# EAGLE design ESP12 Breakout (EAGLE 9.6.2)
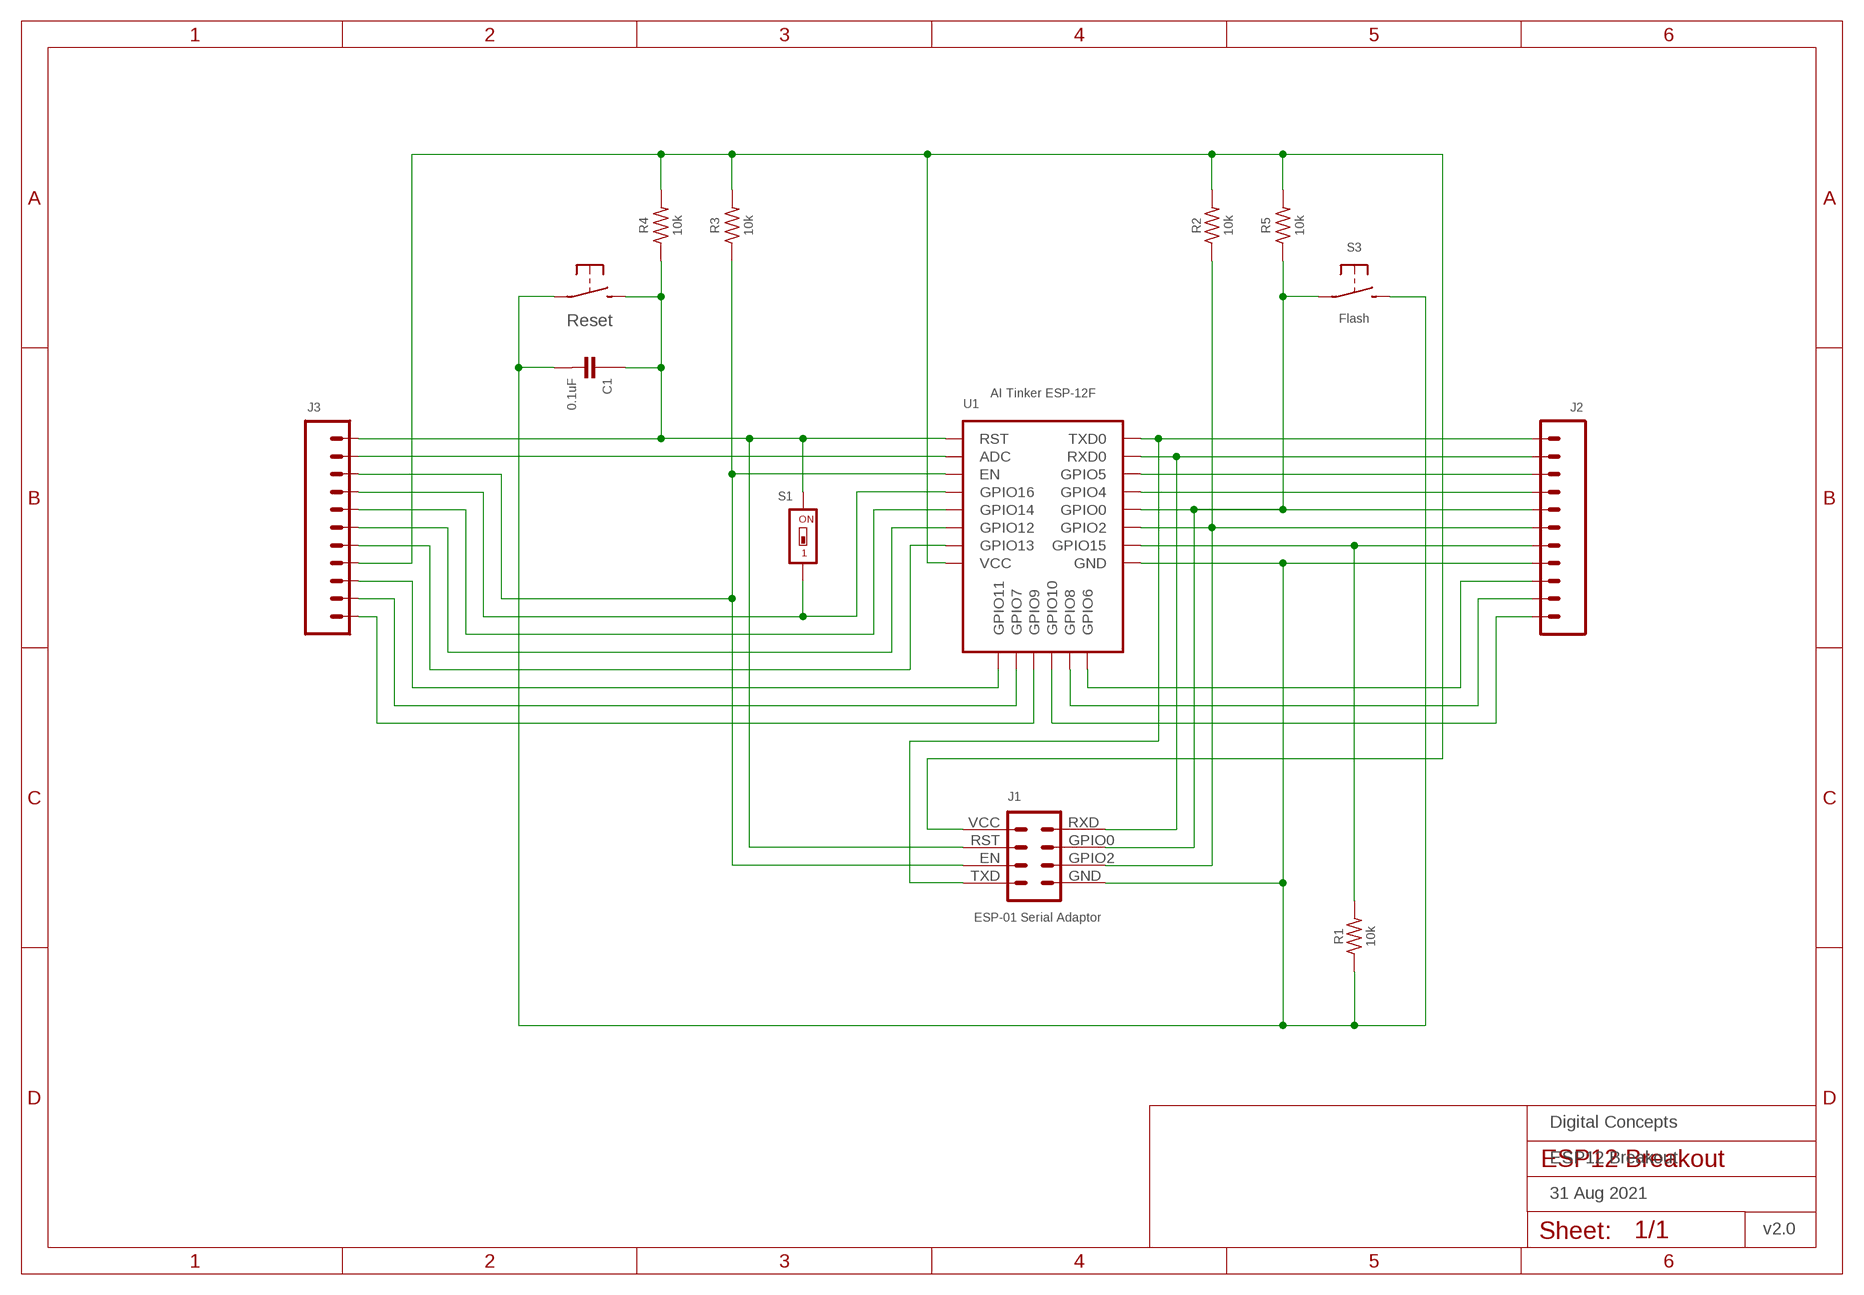
[diagram p0: schematic, sheet 1]
FRAME1 (A4L-LOC): DATE: 31 Aug 2021; OWNER: Digital Concepts; TITLE: ESP12 Breakout; VERSION: v2.0

## Parts
C1  0.1uF  CAPACITOR-0805  [C0805]
J1  ESP-01 Serial Adaptor  ESP-01-SERIAL-ADAPTOR  [CONN_2X4-ESP-01-SERIAL]
J2  HEADER-1X11-GENERIC  [CONN_11-GENERIC]
J3  HEADER-1X11-GENERIC  [CONN_11-GENERIC]
R1  10k  RESISTORR0805  [R0805]
R2  10k  RESISTORR0805  [R0805]
R3  10k  RESISTORR0805  [R0805]
R4  10k  RESISTORR0805  [R0805]
R5  10k  RESISTORR0805  [R0805]
S1  Wake  SWITCH-DIP-SWS001  [SMD-001]
S2  Reset  SWITCH-MOMENTARY-2-PIN  [SWITCH-2-PAD]
S3  Flash  SWITCH-MOMENTARY-2-PIN  [SWITCH-2-PAD]
U1  AI Tinker ESP-12F  ESP-12E/F  [ESP-12E/F]

## Nets
GND: C1.2 J1.GND J2.4 R1.1 S2.P$1(P) S3.P$2(S) U1.GND
N$1: J3.1 U1.GPIO9
N$2: J2.5 R1.2 U1.GPIO15
N$3: J3.7 U1.GPIO14
N$4: C1.1 J1.RST J3.11 R4.1 S1.2 S2.P$2(S) U1.RST
N$5: J3.6 U1.GPIO12
N$6: J3.5 U1.GPIO13
N$7: J3.10 U1.ADC
N$8: J1.EN J3.9 R3.1 U1.EN
N$9: J2.9 U1.GPIO5
N$10: J1.TXD J2.11 U1.TXD0
N$11: J1.GPIO2 J2.6 R2.1 U1.GPIO2
N$12: J2.8 U1.GPIO4
N$13: J1.GPIO0 J2.7 R5.1 S3.P$1(P) U1.GPIO0
N$15: J2.1 U1.GPIO10
N$16: J1.RXD J2.10 U1.RXD0
N$17: J2.3 U1.SCLK(GPIO6)
N$18: J3.8 S1.1 U1.GPIO16
N$19: J2.2 U1.MOSI(GPIO8)
N$22: J3.3 U1.CS0(GPIO11)
N$23: J3.2 U1.MISO(GPIO7)
VCC: J1.VCC J3.4 R2.2 R3.2 R4.2 R5.2 U1.VCC

## Library data of the parts
C1 = digitalconcepts:CAPACITOR-0805: 0805 Capacitor
J1 = digitalconcepts:ESP-01-SERIAL-ADAPTOR: ESP-01 Serial Adpator
J2 J3 = digitalconcepts:HEADER-1X11-GENERIC: Single Row 11-Pin Header
R1-R5 = digitalconcepts:RESISTOR: Resistor; SPICEPREFIX: R
S1 = digitalconcepts:SWITCH-DIP-SWS001: SMD Dip Switch 1 pol.
S2 S3 = digitalconcepts:SWITCH-MOMENTARY-2-PIN: 2 Pin Momentary Switch
U1 = digitalconcepts:ESP-12E/F: AI Thinker ESP-12E/F MCU

## Board
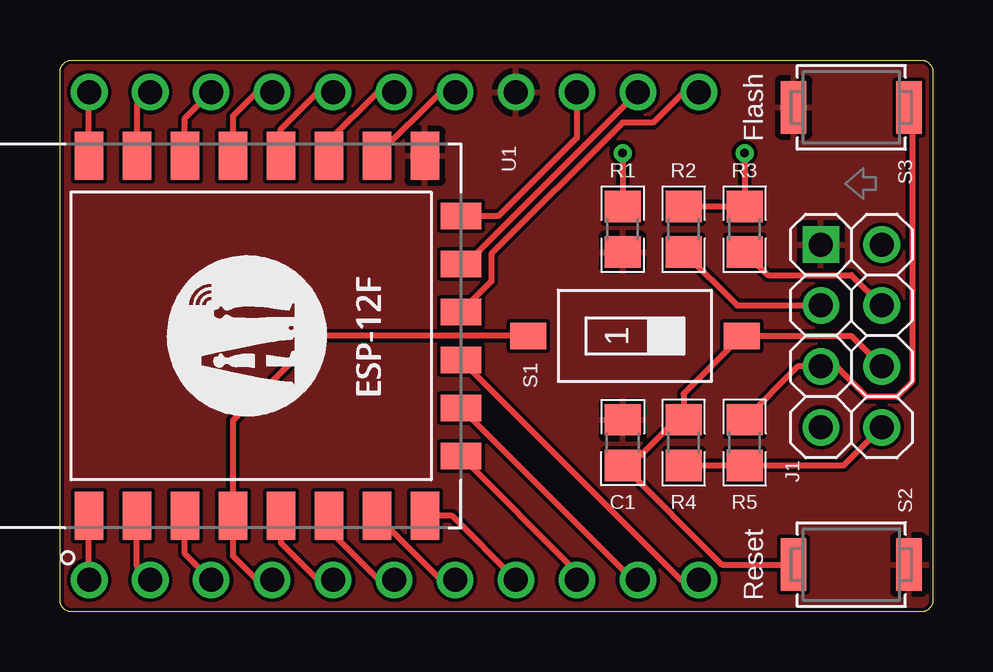
[diagram p1: board, top side]
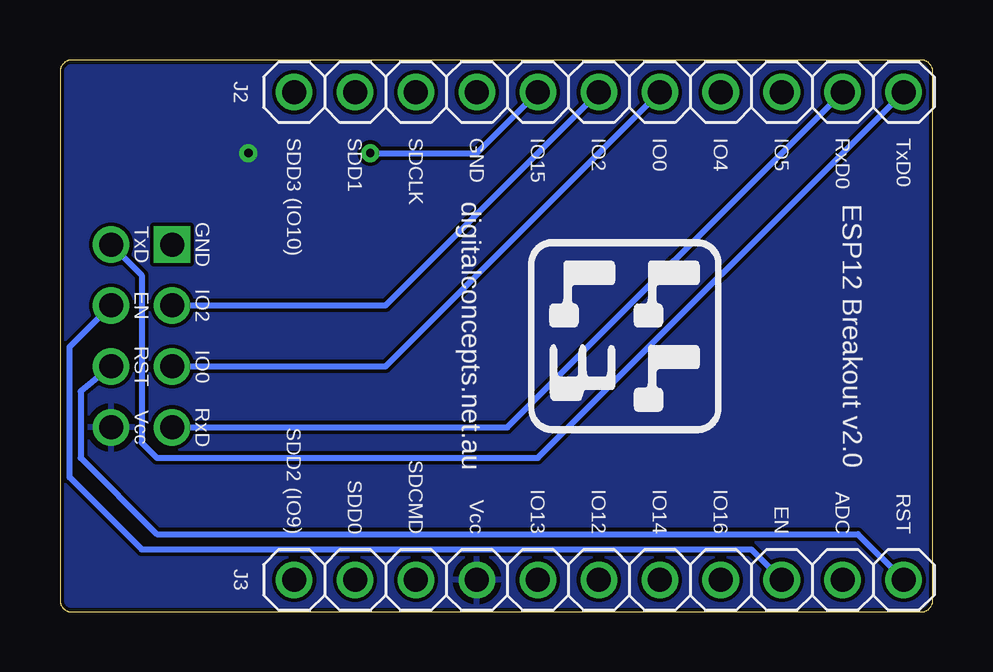
[diagram p2: board, bottom side, seen from below]

Size 36.37 x 23 mm. Coordinates in mm from the lower left corner, seen from the top.
Outline: 35.91,23 35.94,23 35.97,22.99 36.01,22.98 36.04,22.97 36.07,22.96 36.1,22.95 36.13,22.93 36.15,22.91 36.18,22.9 36.2,22.88 36.23,22.85 36.25,22.83 36.27,22.81 36.29,22.78 36.3,22.75 36.32,22.72 36.33,22.69 36.35,22.66 36.36,22.63 36.36,22.6 36.37,22.57 36.37,22.53 36.37,0.47 36.37,0.43 36.36,0.4 36.36,0.37 36.35,0.34 36.33,0.31 36.32,0.28 36.3,0.25 36.29,0.22 36.27,0.19 36.25,0.17 36.2,0.12 36.18,0.1 36.15,0.09 36.13,0.07 36.1,0.05 36.07,0.04 36.04,0.03 36.01,0.02 35.97,0.01 35.94,0 35.91,0 0.47,0 0.43,0 0.4,0.01 0.37,0.02 0.34,0.03 0.28,0.05 0.25,0.07 0.22,0.09 0.19,0.1 0.17,0.12 0.12,0.17 0.1,0.19 0.09,0.22 0.07,0.25 0.05,0.28 0.04,0.31 0.03,0.34 0.02,0.37 0.01,0.4 0,0.43 0,0.47 0,22.53 0,22.57 0.01,22.6 0.02,22.63 0.03,22.66 0.04,22.69 0.05,22.72 0.07,22.75 0.09,22.78 0.1,22.81 0.12,22.83 0.15,22.85 0.17,22.88 0.19,22.9 0.22,22.91 0.25,22.93 0.28,22.95 0.34,22.97 0.37,22.98 0.4,22.99 0.43,23 0.47,23 35.91,23
Copper layers (1*16): Top 0.035mm / dielectric 1.5mm / Bottom 0.035mm
Design rules "default *": minimum track width 6mil, minimum drill 0.35mm, track to track 6mil, track to pad 6mil, pad to pad 6mil, via to via 6mil, smd to smd 6mil, copper to edge 6mil, drill to drill 6mil, minimum pad ring 10mil, minimum via ring 8mil, stop-mask expansion 4mil, vias tented up to drill 0mil, thermal gap 10mil

### Footprints (pad centres in the part's own frame; a part is rotated, then mirrored left to right if it is on the bottom)
C0805 = smd 1.3 x 1.5: 1 -0.95,0; 2 0.95,0
CONN_2X4-ESP-01-SERIAL = drill 1 pad 1.524: EN 2.54,2.54; GPIO0 5.08,0; GPIO2 2.54,0; RST 5.08,2.54; RXD 7.62,0; TXD 0,2.54; VCC 7.62,2.54 | drill 1 pad 1.524 square: GND 0,0
CONN_11-GENERIC = drill 1 pad 1.524: 1 0,0; 2 2.54,0; 3 5.08,0; 4 7.62,0; 5 10.16,0; 6 12.7,0; 7 15.24,0; 8 17.78,0; 9 20.32,0; 10 22.86,0; 11 25.4,0
R0805 = smd 1.3 x 1.5: 1 -0.95,0; 2 0.95,0
SMD-001 = smd 1.1 x 1.5: 1 0,-4.45; 2 0,4.45
SWITCH-2-PAD = smd 1.067 x 2.184: P$1 -2.4,0; P$2 2.4,0
ESP-12E/F = smd 2 x 1.2: ADC -7.5,5; EN -7.5,3; GND 7.5,-7; GPIO0 7.5,-1; GPIO2 7.5,-3; GPIO4 7.5,1; GPIO5 7.5,3; GPIO12 -7.5,-3; GPIO13 -7.5,-5; GPIO14 -7.5,-1; GPIO15 7.5,-5; GPIO16 -7.5,1; RST -7.5,7; RXD0 7.5,5; TXD0 7.5,7; VCC -7.5,-7 | smd 1.1 x 1.7: CS0 -5,-8.5; GPIO9 -1,-8.5; GPIO10 1,-8.5; MISO -3,-8.5; MOSI 3,-8.5; SCLK 5,-8.5

### Placement (x,y rotation side)
C1  23.44,7.06 90 top
J1  31.7,15.31 270 top
J2  26.62,21.66 0 bottom
J3  26.62,1.34 0 bottom
R1  23.44,15.95 90 top
R2  25.98,15.95 90 top
R3  28.52,15.95 90 top
R4  25.98,7.06 270 top
R5  28.52,7.06 270 top
S1  23.95,11.5 270 top
S2  32.97,1.98 180 top
S3  32.97,21.03 180 top
U1  8.2,11.5 90 top

### Tracks (layer width: path | path; a pad name or v marks a point on that pad's centre or on a via)
GND
  pour Top (rank 3): -1.32,24.2 37.41,24.2 37.41,-1.2 -1.32,-1.2
N$1
  Top 0.254: U1.GPIO9 25.86,1.34 J3.1
N$2  (via drill 0.35)
  Top 0.254: U1.GPIO15 15.86,21.66 J2.5 | v23.44,19.12 R1.2
  Bottom 0.254: J2.5 19,19.12 v23.44,19.12
N$3
  Top 0.254: U1.GPIO14 9.2,2.88 10.74,1.34 J3.7
N$4
  Top 0.254: J1.RST 32.97,11.5 S1.2 25.98,9.08 R4.1 25.68,8.01 23.78,6.11 C1.1 27.57,1.98 S2.P$2 | J3.11 1.2,1.36 U1.RST
  Bottom 0.254: J1.RST 35.51,9.19 35.51,6.42 32.33,3.25 3.12,3.25 J3.11
N$5
  Top 0.254: U1.GPIO12 11.2,3.42 13.28,1.34 J3.6
N$6
  Top 0.254: U1.GPIO13 15.86,1.34 J3.5
N$7
  Top 0.254: U1.ADC 3.2,1.9 J3.10
N$8
  Top 0.254: R3.1 29.48,14.04 32.97,14.04 J1.EN | U1.EN 5.2,2.44 J3.9
  Bottom 0.254: J1.EN 35.97,11.04 35.97,5.61 32.97,2.61 7.57,2.61 J3.9
N$9
  Top 0.254: U1.GPIO5 5.2,20.39 5.2,20.57 J2.9
N$10
  Top 0.254: U1.TXD0 1.2,21.65 J2.11
  Bottom 0.254: J1.TXD 32.97,14.04 32.97,7.06 32.33,6.42 16.46,6.42 J2.11
N$11
  Top 0.254: U1.GPIO2 11.2,19.64 13.23,21.66 J2.6 | R2.1 28.21,12.77 J1.GPIO2
  Bottom 0.254: J1.GPIO2 22.81,12.77 J2.6
N$12
  Top 0.254: U1.GPIO4 7.2,20.66 8.2,21.66 J2.8
N$13
  Top 0.254: U1.GPIO0 9.2,20.12 | 9.2,20.12 | 9.2,20.12 10.74,21.66 J2.7 | R5.1 30.75,10.23 J1.GPIO0 32.33,10.23 33.6,8.96 34.87,8.96 35.51,9.6 35.51,20.89 S3.P$1
  Bottom 0.254: J1.GPIO0 22.81,10.23 J2.7
N$15
  Top 0.254: U1.GPIO10 17.97,13.77 17.97,14.92 23.44,20.39 24.71,20.39 25.98,21.66 J2.1
N$16
  Top 0.254: U1.RXD0 3.2,21.11 J2.10
  Bottom 0.254: J1.RXD 17.73,7.69 J2.10
N$17
  Top 0.254: U1.SCLK 18.28,16.5 21.54,19.76 J2.3
N$18
  Top 0.254: S1.1 10.74,11.5 7.2,7.96 U1.GPIO16 7.2,2.34 8.2,1.34 J3.8
N$19
  Top 0.254: J2.2 16.92,14.5 U1.MOSI
N$22
  Top 0.254: U1.CS0 21.54,1.67 J3.3
N$23
  Top 0.254: U1.MISO 23.86,1.34 J3.2
VCC  (via drill 0.35)
  Top 0.254: U1.VCC 16.34,4 J3.4 | R4.2 R5.2 32.65,6.11 J1.VCC | R2.2 R3.2 v28.52,19.12
  pour Bottom (rank 3): -0.69,23.57 36.78,23.57 36.78,-0.56 -0.69,-0.56

### Text on the board
bPlace: TxD0 | RxD0 | IO5 | IO4 | IO0 | IO2 | IO15 | GND | SDCLK | SDD1 | SDD3 (IO10) | GND | TxD | IO2 | EN | ESP12 Breakout v2.0 | digitalconcepts.net.au | IO0 | RST | RxD | Vcc | RST | ADC | EN | IO16 | IO14 | IO12 | IO13 | Vcc | SDCMD | SDD0 | SDD2 (IO9)